# EAGLE design decoder (EAGLE 7.2.0)
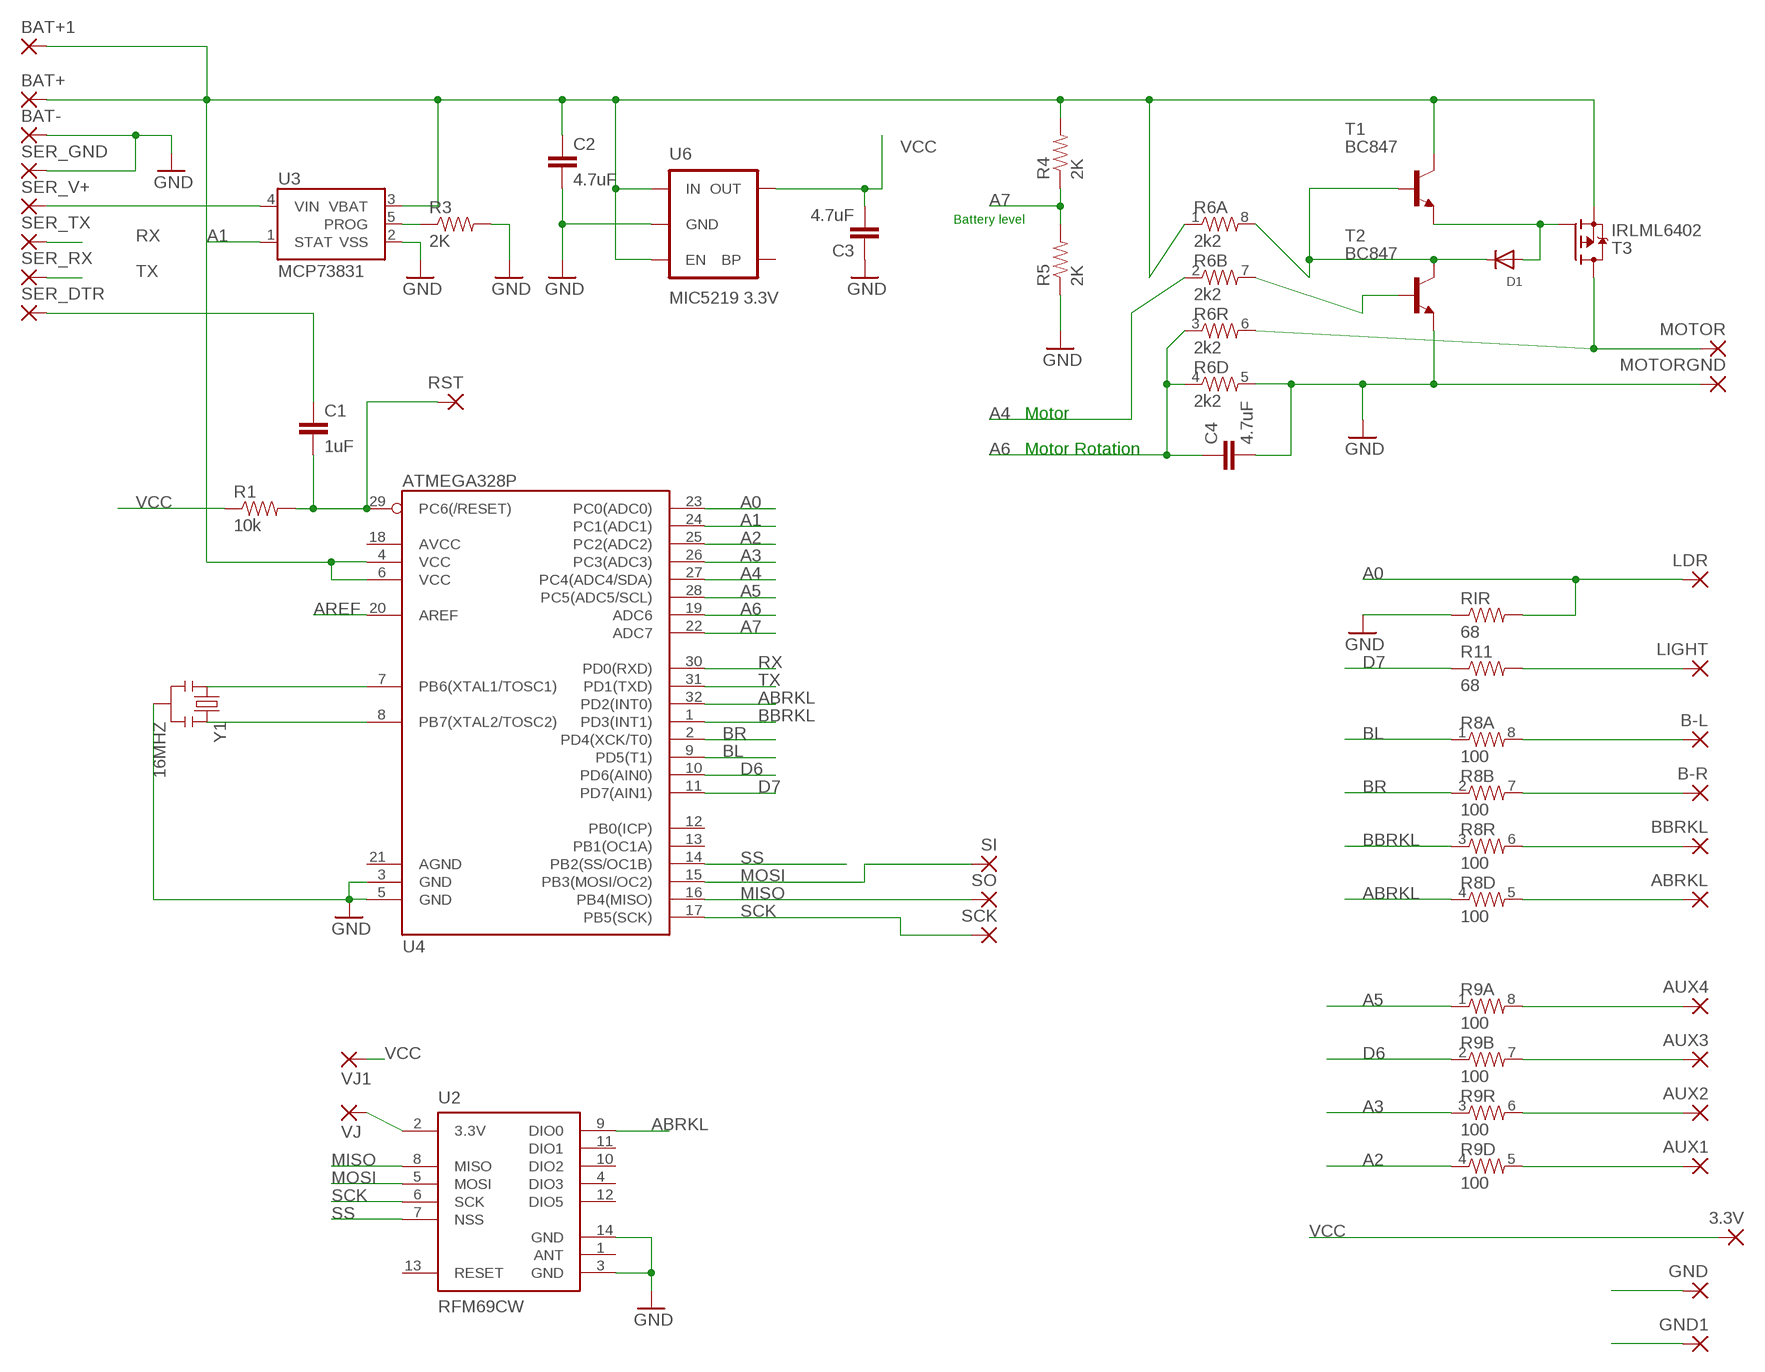
[diagram p0: schematic, sheet 1]

## Parts
3.3V  SMD2  [SMD1,27-2,54]
ABRKL  SMD2  [SMD1,27-2,54]
AUX1  SMD2  [SMD1,27-2,54]
AUX2  SMD2  [SMD1,27-2,54]
AUX3  SMD2  [SMD1,27-2,54]
AUX4  SMD2  [SMD1,27-2,54]
B-L  SMD2  [SMD1,27-2,54]
B-R  SMD2  [SMD1,27-2,54]
BAT+  SMD2  [SMD1,27-2,54]
BAT+1  SMD2  [SMD1,27-2,54]
BAT-  SMD2  [SMD1,27-2,54]
BBRKL  SMD2  [SMD1,27-2,54]
C1  1uF  CAP0805  [0805]
C2  4.7uF  CAP0805  [0805]
C3  4.7uF  CAP0805  [0805]
C4  4.7uF  CAP0805  [0805]
D1  DIODESOD-523  [SOD-523]
GND  SMD2  [SMD1,27-2,54]
GND1  SMD2  [SMD1,27-2,54]
LDR  SMD2  [SMD1,27-2,54]
LIGHT  SMD2  [SMD1,27-2,54]
MOTOR  SMD2  [SMD1,27-2,54]
MOTORGND  SMD2  [SMD1,27-2,54]
R1  10k  RESISTOR0603-RES  [0603-RES]
R3  2K  RESISTOR0603-RES  [0603-RES]
R4  2K  RESISTOR0603-RES  [0603-RES]
R5  2K  RESISTOR0603-RES  [0603-RES]
R6  2k2  RESISTOR-ARRAY0603-ARV  [0603-ARV]
R8  100  RESISTOR-ARRAY0603-ARV  [0603-ARV]
R9  100  RESISTOR-ARRAY0603-ARV  [0603-ARV]
R11  68  RESISTOR0603-RES  [0603-RES]
RIR  68  RESISTOR0603-RES  [0603-RES]
RST  SMD2  [SMD1,27-2,54]
SCK  SMD2  [SMD1,27-2,54]
SER_DTR  SMD2  [SMD1,27-2,54]
SER_GND  SMD2  [SMD1,27-2,54]
SER_RX  SMD2  [SMD1,27-2,54]
SER_TX  SMD2  [SMD1,27-2,54]
SER_V+  SMD2  [SMD1,27-2,54]
SI  SMD2  [SMD1,27-2,54]
SO  SMD2  [SMD1,27-2,54]
T1  BC847  [SOT23]
T2  BC847  [SOT23]
T3  IRLML6402  MOSFET-P-SOT23  [SOT23]
U2  RFM69CW  [RFM69CW-XXXS2]
U3  MCP73831  [SOT23-5]
U4  ATMEGA328P  ATMEGA328_SMT  [TQFP32-08]
U6  MIC5219 3.3V  V_REG_MIC52193.3V  [SOT23-5]
VJ  SMD2  [SMD1,27-2,54]
VJ1  SMD2  [SMD1,27-2,54]
Y1  16MHZ  RESONATOR16MHZ  [RESONATOR-SMD]

## Nets
A0: LDR.1(P) RIR.2 U4.23(PC0(ADC0))
A1: U3.1(STAT) U4.24(PC1(ADC1))
A2: R9.4 U4.25(PC2(ADC2))
A3: R9.3 U4.26(PC3(ADC3))
A4: R6.2 U4.27(PC4(ADC4/SDA))
A5: R9.1 U4.28(PC5(ADC5/SCL))
A6: C4.1 R6.3 R6.4 U4.19(ADC6)
A7: R4.1 R5.2 U4.22(ADC7)
ABRKL: R8.4 U2.9(DIO0) U4.32(PD2(INT0))
AREF: U4.20(AREF)
BAT+: BAT+1.1(P) BAT+.1(P) C2.1 R4.2 R6.1 T1.3(C) T3.2(S) U3.3(VBAT) U4.4(VCC) U4.6(VCC) U6.1(IN) U6.3(EN)
BBRKL: R8.3 U4.1(PD3(INT1))
BL: R8.1 U4.9(PD5(T1))
BR: R8.2 U4.2(PD4(XCK/T0))
D6: R9.2 U4.10(PD6(AIN0))
D7: R11.1 U4.11(PD7(AIN1))
GND: BAT-.1(P) C2.2 C3.1 C4.2 GND1.1(P) GND.1(P) MOTORGND.1(P) R3.2 R5.1 R6.5 RIR.1 SER_GND.1(P) T2.2(E) U2.3(GND) U2.14(GND) U3.2(VSS) U4.3(GND) U4.5(GND) U6.2(GND) Y1.2
M: AUX1.1(P) R9.5
MISO: SO.1(P) U2.8(MISO) U4.16(PB4(MISO))
MOSI: SI.1(P) U2.5(MOSI) U4.15(PB3(MOSI/OC2))
N$1: U2.2(3.3V) VJ.1(P)
N$2: U4.7(PB6(XTAL1/TOSC1)) Y1.1
N$3: C1.1 SER_DTR.1(P)
N$4: U4.8(PB7(XTAL2/TOSC2)) Y1.3
N$5: C1.2 R1.2 RST.1(P) U4.29(PC6(/RESET))
N$9: SER_V+.1(P) U3.4(VIN)
N$11: R3.1 U3.5(PROG)
N$12: LIGHT.1(P) R11.2
N$13: B-L.1(P) R8.8
N$14: D1.A T1.2(E) T3.1(G)
N$15: MOTOR.1(P) R6.6 T3.3(D)
N$16: B-R.1(P) R8.7
N$17: R6.7 T2.1(B)
N$18: BBRKL.1(P) R8.6
N$19: D1.K(C) R6.8 T1.1(B) T2.3(C)
N$20: ABRKL.1(P) R8.5
N$21: AUX4.1(P) R9.8
N$22: AUX3.1(P) R9.7
N$23: AUX2.1(P) R9.6
RX: SER_TX.1(P) U4.30(PD0(RXD))
SCK: SCK.1(P) U2.6(SCK) U4.17(PB5(SCK))
SS: U2.7(NSS) U4.14(PB2(SS/OC1B))
TX: SER_RX.1(P) U4.31(PD1(TXD))
VCC: 3.3V.1(P) C3.2 R1.1 U6.5(OUT) VJ1.1(P)
Unconnected: U2.1(ANT) U2.4(DIO3) U2.10(DIO2) U2.11(DIO1) U2.12(DIO5) U2.13(RESET) U4.12(PB0(ICP)) U4.13(PB1(OC1A)) U4.18(AVCC) U4.21(AGND) U6.4(BP)

## Notes on the sheet
- Battery level
- Motor
- Motor Rotation

## Library data of the parts
3.3V ABRKL AUX1-AUX4 B-L B-R BAT+ BAT+1 BAT- BBRKL GND GND1 LDR LIGHT MOTOR MOTORGND RST SCK SER_DTR SER_GND SER_RX SER_TX SER_V+ SI SO VJ VJ1 = wirepad:SMD2: SMD PAD
C1-C4 = SparkFun-Capacitors:CAP: Capacitor Standard 0603 ceramic capacitor, and 0.1" leaded capacitor.
D1 = adafruit:DIODE: Diode SMADIODE - SMA Surface Mount Package 20V 1A Schottky Diode Digikey: 641-1014-6-ND DO-1N4148 - Through Hole Small Current Diode SOD-123 20V 1 A (.5mV Vf) Schottky Diode - Digikey: MBRX120TPMSCT-ND SOD-323 10V 570mA (.38mV Vf, 3ns) Schottky Diode - Digikey: ZLLS410CT-ND SOD-523 30V 30mA Schottky Diode (RB751S-40TE61) - Digikey: RB751S-40TE61CT-ND SOT23-R/W - SOT23 Package (R = Solder Paste/Reflow Ovens, W = Hand-Soldering) BAT54Film 40V 300mA - Digikey: 497-7162-1-ND
R1 R3-R5 R11 RIR = SparkFun-Resistors:RESISTOR: Resistor Basic schematic elements and footprints for 0603, 1206, and PTH resistors.
R6 R8 R9 = SparkFun-Resistors:RESISTOR-ARRAY: Array Chip Resistor Source: RS Component / Phycomp
T1 T2 = transistor:BC847: NPN TRANSISTOR
T3 = we-transistor:MOSFET-P: P-Channel MOSFET (e.g. IRLML6402)
U2 = SparkFun-RF:RFM69
U3 = SparkFun-PowerIC:MCP73831: Miniature single cell, fully integrated Li-Ion, Li-polymer charge management controller http://ww1.microchip.com/downloads/en/DeviceDoc/21984a.pdf IC-09995; PROD_ID: IC-09995
U4 = SparkFun-DigitalIC:ATMEGA328_SMT: 32-Pin Atmega328 part Commonly used on Arduino compatible boards Available in QFP and QFN packages TQFP is IC-09069 QFN is non-stock; PROD_ID: IC-09069
U6 = SparkFun-PowerIC:V_REG_MIC5219: V_REG MIC5219 Standard 3.3V and 5V 500mA LDO voltage regulator in SOT-23 layout. Micrel part MIC5219. BP (by-pass) pin is used to lower output noise with 470pF cap, may be left open.; PROD_ID: VREG-09872
Y1 = SparkFun-FreqCtrl:RESONATOR: Resonator Small SMD resonator. Used, eg, on the Arduino Pro/ Pro Mini boards. 8MHz- XTAL-08895 16MHz- XTAL-08900; PROD_ID: XTAL-08900

## Board
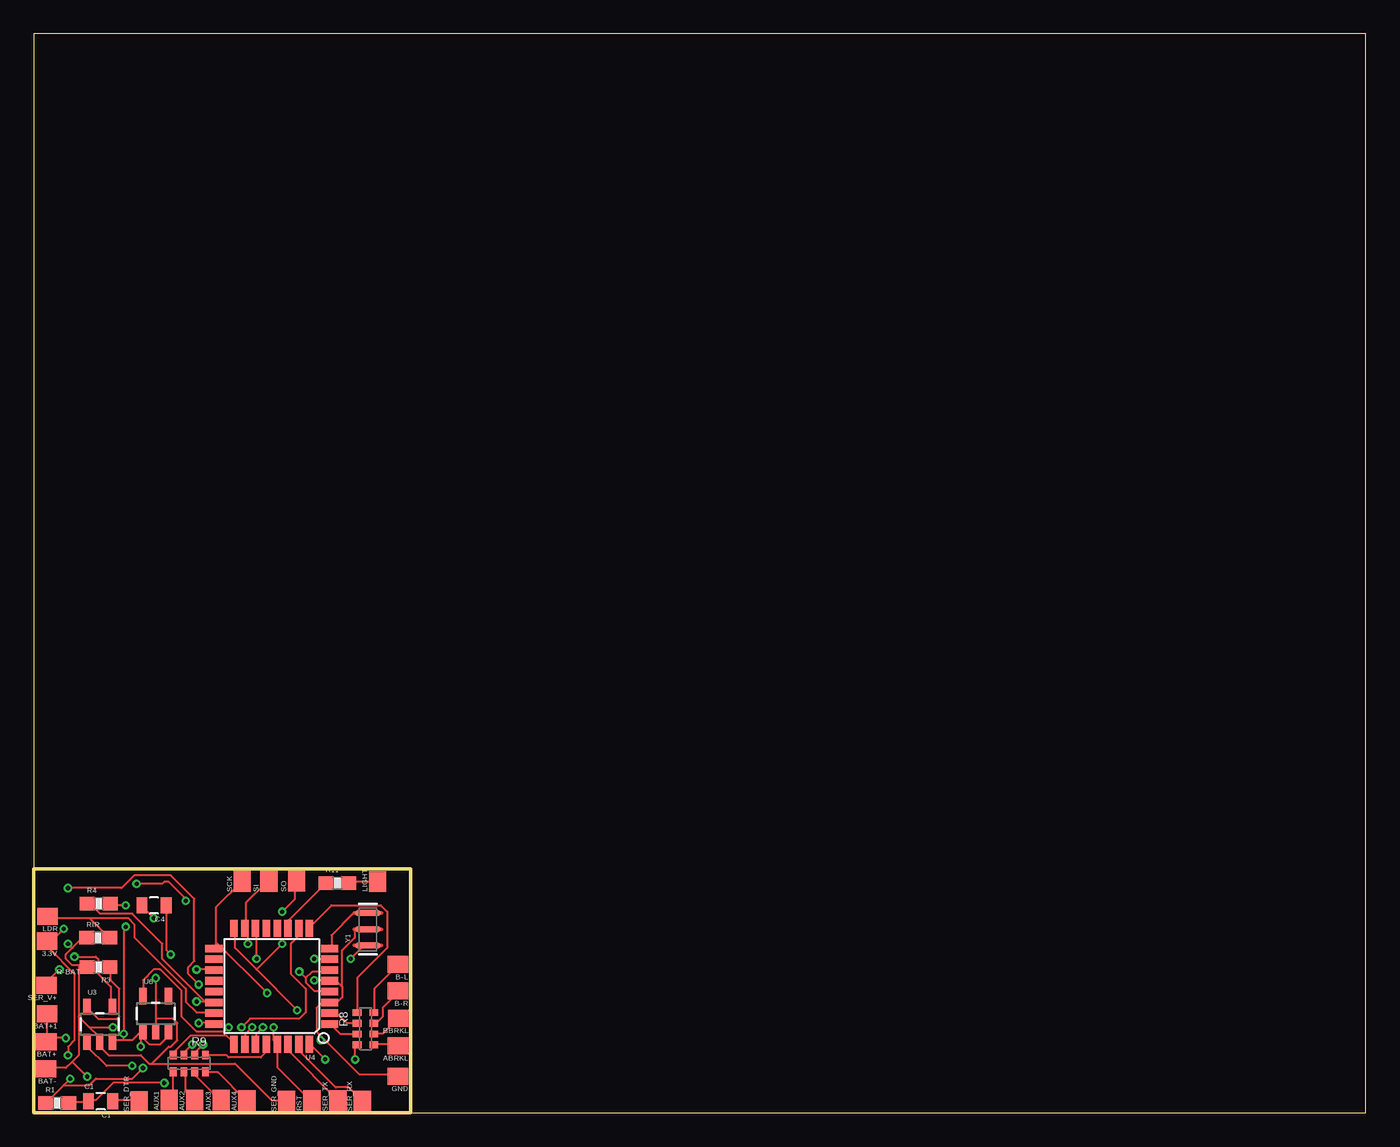
[diagram p1: board, top side]
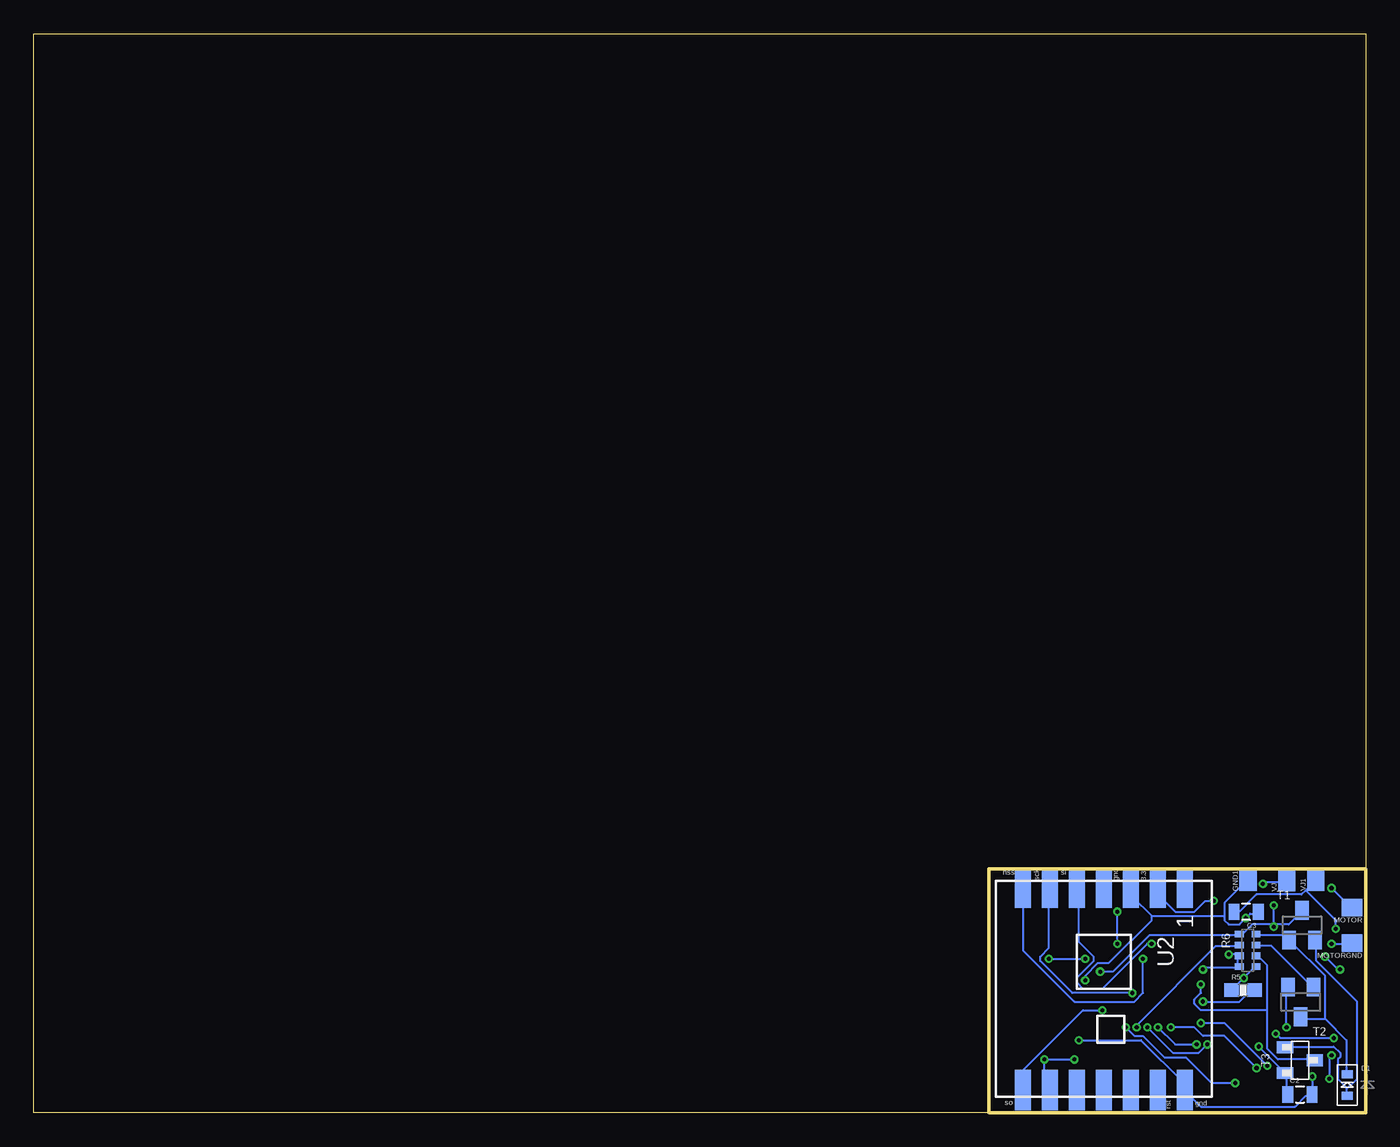
[diagram p2: board, bottom side, seen from below]

Size 98.73 x 80 mm. Coordinates in mm from the lower left corner, seen from the top.
Outline: 27.95,0 98.73,0 98.73,80 0,80 0,18.09
Outline: 0,18.09 27.95,18.09 27.95,0
Outline: 27.95,0 0,0 0,18.09
Copper layers (1*16): Top 0.035mm / dielectric 1.5mm / Bottom 0.035mm
Design rules "Elecrow_2-layer_eagle_rule": minimum track width 6mil, minimum drill 12mil, track to track 6mil, track to pad 6mil, pad to pad 6mil, via to via 6mil, smd to smd 0mil, copper to edge 10mil, drill to drill 10mil, minimum pad ring 10mil, minimum via ring 6mil, stop-mask expansion 2mil, vias tented up to drill 100mil, thermal gap 10mil

### Footprints (pad centres in the part's own frame; a part is rotated, then mirrored left to right if it is on the bottom)
SMD1,27-2,54 = smd 1.27 x 1.524: 1 0,0
0805 = smd 0.8 x 1.2: 1 -0.9,0; 2 0.9,0
SOD-523 = smd 0.8 x 0.6: A 0,-0.8; K 0,0.8
0603-RES = smd 1.1 x 1: 1 -0.85,0; 2 0.85,0
0603-ARV = smd 0.5 x 0.65: 1 -1.2,-0.625; 2 -0.4,-0.625; 3 0.4,-0.625; 4 1.2,-0.625; 5 1.2,0.625; 6 0.4,0.625; 7 -0.4,0.625; 8 -1.2,0.625
SOT23 = smd 1 x 1.4: 1 -0.95,-1.1; 2 0.95,-1.1; 3 0,1.1
SOT23' = smd 1.3 x 0.9: 1 -1.1,0.95; 2 -1.1,-0.95; 3 1.1,0
RFM69CW-XXXS2 = smd 3 x 1.2: 1 -7.5,6; 2 -7.5,4; 3 -7.5,2; 4 -7.5,0; 5 -7.5,-2; 6 -7.5,-4; 7 -7.5,-6; 8 7.5,-6; 9 7.5,-4; 10 7.5,-2; 11 7.5,0; 12 7.5,2; 13 7.5,4; 14 7.5,6
SOT23-5 = smd 0.55 x 1.2: 1 -0.95,-1.3; 2 0,-1.3; 3 0.95,-1.3; 4 0.95,1.3; 5 -0.95,1.3
TQFP32-08 = smd 1.27 x 0.559: 1 -4.293,2.8; 2 -4.293,2; 3 -4.293,1.2; 4 -4.293,0.4; 5 -4.293,-0.4; 6 -4.293,-1.2; 7 -4.293,-2; 8 -4.293,-2.8; 17 4.293,-2.8; 18 4.293,-2; 19 4.293,-1.2; 20 4.293,-0.4; 21 4.293,0.4; 22 4.293,1.2; 23 4.293,2; 24 4.293,2.8 | smd 0.559 x 1.27: 9 -2.8,-4.293; 10 -2,-4.293; 11 -1.2,-4.293; 12 -0.4,-4.293; 13 0.4,-4.293; 14 1.2,-4.293; 15 2,-4.293; 16 2.8,-4.293; 25 2.8,4.293; 26 2,4.293; 27 1.2,4.293; 28 0.4,4.293; 29 -0.4,4.293; 30 -1.2,4.293; 31 -2,4.293; 32 -2.8,4.293
RESONATOR-SMD = smd 0.45 x 1.905: 1 -1.2,0; 2 0,0; 3 1.2,0

### Placement (x,y rotation side)
3.3V  0.98,12.74 90 top
ABRKL  27.01,4.98 90 top
AUX1  10.04,0.97 0 top
AUX2  11.93,0.95 0 top
AUX3  13.89,0.95 0 top
AUX4  15.8,0.93 0 top
B-L  26.99,11.01 90 top
B-R  26.99,9.04 90 top
BAT+  0.92,5.28 90 top
BAT+1  0.97,7.36 90 top
BAT-  0.91,3.28 90 top
BBRKL  27.02,7.02 90 top
C1  4.96,0.86 180 top
C2  4.88,1.37 0 bottom
C3  8.87,14.91 180 bottom
C4  8.91,15.38 180 top
D1  1.37,2.08 0 bottom
GND  26.98,2.72 90 top
GND1  8.72,17.21 0 bottom
LDR  1.02,14.58 90 top
LIGHT  25.49,17.15 0 top
MOTOR  1.02,15.23 90 bottom
MOTORGND  1.02,12.6 90 bottom
R1  1.75,0.74 0 top
R3  4.81,10.81 180 top
R4  4.81,15.52 0 top
R5  9.09,9.09 0 bottom
R6  8.75,12.05 270 bottom
R8  24.59,6.25 270 top
R9  11.53,3.67 180 top
R11  22.5,17.05 0 top
RIR  4.77,12.99 0 top
RST  20.62,0.92 0 top
SCK  15.46,17.17 0 top
SER_DTR  7.81,0.86 0 top
SER_GND  18.75,0.87 0 top
SER_RX  24.36,0.9 0 top
SER_TX  22.55,0.91 0 top
SER_V+  0.95,9.47 90 top
SI  17.43,17.17 0 top
SO  19.48,17.17 0 top
T1  4.72,13.92 0 bottom
T2  4.83,8.23 180 bottom
T3  IRLML6402  [SOT23']  4.88,3.91 0 bottom
U2  19.41,9.19 270 bottom
U3  4.89,6.57 0 top
U4  17.65,9.4 180 top
U6  9.04,7.37 0 top
VJ  5.84,17.18 0 bottom
VJ1  3.7,17.23 0 bottom
Y1  24.77,13.62 90 top

### Tracks (layer width: path | path; a pad name or v marks a point on that pad's centre or on a via)
A0
  Top 0.152: 4.13,14.45 5.56,13.02 RIR.2 | 4.13,14.45 1.11,14.45 LDR.1 | 4.13,14.45 6.99,14.45 7.46,13.97 7.46,13.02 11.27,9.21 11.27,8.26 12.07,7.46 13.34,7.46 U4.23
A1  (via drill 0.3)
  Top 0.152: v7.3,3.49 5.4,3.49 3.97,4.92 3.97,5.24 U3.1 | v12.22,6.67 13.34,6.67 U4.24
  Bottom 0.152: v7.3,3.49 10.48,6.67 v12.22,6.67
A2
  Top 0.152: R9.4 10.48,4.45 10.48,4.6 11.59,5.71 14.29,5.71 14.76,5.24 U4.25
A3  (via drill 0.3)
  Top 0.152: v11.75,5.08 11.27,4.6 11.27,4.45 R9.3 | v16.19,6.35 15.72,5.87 15.72,5.24 U4.26
  Bottom 0.152: v11.75,5.08 12.38,4.45 14.29,4.45 v16.19,6.35
A4  (via drill 0.3)
  Top 0.152: v16.99,6.35 16.51,5.87 16.51,5.24 U4.27
  Bottom 0.152: v16.99,6.35 16.99,6.51 11.11,12.38 9.53,12.38 R6.2
A5
  Top 0.152: R9.1 12.86,4.29 14.29,4.29 14.45,4.13 16.83,4.13 17.14,4.45 17.14,5.08 U4.28
A6  (via drill 0.3)
  Top 0.152: v12.07,10.64 13.34,10.64 U4.19 | v10.16,11.75 9.84,12.06 9.84,15.24 C4.1
  Bottom 0.152: v12.07,10.64 11.91,10.79 9.53,10.79 R6.4 9.53,10.95 9.53,11.59 R6.3 9.53,11.75 v10.16,11.75
A7  (via drill 0.3)
  Top 0.152: 12.7,8.26 13.34,8.26 U4.22 | 12.7,8.26 v12.07,8.26 | 12.7,8.26 9.53,11.43 9.53,12.54 7.3,14.76 4.92,14.76 4.29,15.4 3.97,15.4 R4.1
  Bottom 0.152: v12.07,8.26 9.37,8.26 8.57,9.05 8.26,9.05 R5.2
ABRKL  (via drill 0.3)
  Top 0.152: v23.81,3.97 23.81,4.92 R8.4 | v21.59,3.97 20.48,5.08 U4.32
  Bottom 0.152: U2.9 23.5,1.75 23.81,2.06 v23.81,3.97 v21.59,3.97
BAT+  (via drill 0.3)
  Top 0.152: 0.95,5.56 0.95,7.3 BAT+1.1 | 0.95,5.56 0.95,5.4 BAT+.1 0.95,5.56 | 6.67,5.4 7.3,5.4 7.78,5.87 | 6.67,5.4 5.87,5.4 U3.3 | 7.78,5.87 7.94,6.03 U6.1 7.94,5.71 | 7.78,5.87 7.94,5.71 | 7.94,5.71 8.57,5.08 9.37,5.08 9.84,5.56 9.84,6.03 U6.3 | 7.94,5.71 v7.94,4.92 | v2.38,5.56 0.95,5.56 | 6.67,5.4 v6.67,5.87 6.67,13.65 v6.83,13.81 | 20.16,10 20.16,9.68 20.8,9.05 21.91,9.05 U4.4 | 20.16,10 20.64,10.48 21.91,10.48 U4.6 | v6.83,15.4 5.71,15.4 R4.2 | v19.68,10.48 20.16,10
  Bottom 0.152: C2.1 5.87,1.43 5.87,2.86 T3.2 6.03,3.02 v7.94,4.92 | v2.38,5.56 6.35,5.56 v6.67,5.87 | 6.83,13.97 5.71,13.97 4.76,14.92 T1.3 | 6.83,13.97 8.41,13.97 9.05,13.34 9.37,13.34 R6.1 9.53,13.18 16.03,13.18 18.73,10.48 v19.68,10.48 | 6.83,13.97 v6.83,15.4 | 6.83,13.97 v6.83,13.81
BBRKL
  Top 0.152: R8.3 23.81,5.87 22.7,5.87 22.07,6.51 U4.1
BL
  Top 0.152: R8.1 23.97,7.46 23.97,10 26.19,12.22 26.19,14.92 25.72,15.4 22.07,15.4 20.48,13.81 U4.9
BR
  Top 0.152: R8.2 23.81,6.67 23.18,6.67 22.54,7.3 22.07,7.3 U4.2
D6  (via drill 0.3)
  Top 0.152: v12.54,5.08 12.07,4.6 12.07,4.45 R9.2 | v15.4,6.35 16.03,6.99 19.68,6.99 20.16,7.46 20.16,9.21 19.05,10.32 19.05,12.54 19.53,13.02 19.53,13.65 U4.10
  Bottom 0.152: v12.54,5.08 14.13,5.08 v15.4,6.35
D7
  Top 0.152: R11.1 21.59,16.99 18.89,14.29 18.89,13.81 U4.11
GND  (via drill 0.3)
  Top 0.152: v9.05,10 9.05,6.99 | 9.05,6.99 9.05,6.19 U6.2 | 2.86,12.22 2.38,11.75 2.38,11.43 2.86,10.95 3.33,10.95 | 2.86,12.22 3.49,12.86 3.81,12.86 RIR.1 | 3.33,10.95 3.81,10.95 R3.2 | 3.33,7.14 4.13,6.35 | 4.13,6.35 4.76,5.71 4.76,5.4 U3.2 4.92,5.24 4.92,4.92 5.56,4.29 7.94,4.29 8.57,3.65 8.73,3.65 | 3.33,10.95 3.33,7.14 | 4.13,6.35 v5.87,6.35 | 8.73,3.65 14.92,3.65 17.62,0.95 18.73,0.95 SER_GND.1 | 2.86,3.81 3.33,4.29 3.33,7.14 | 2.86,3.81 2.38,3.33 0.95,3.33 BAT-.1 | 2.86,12.22 v2.54,12.54 | 9.05,6.99 10.32,6.99 10.64,6.67 10.64,5.4 10.16,4.92 10,4.92 8.73,3.65 | 2.86,3.81 v3.97,2.7 | v8.89,14.45 8.1,15.24 C4.2 | 22.86,9.37 22.86,8.57 22.54,8.26 22.07,8.26 U4.3 21.91,8.1 21.27,8.1 20.96,7.78 20.96,6.03 21.43,5.56 | 22.86,9.37 22.54,9.68 22.07,9.68 U4.5 21.91,9.84 v20.8,9.84 | 21.43,5.56 24.13,2.86 26.83,2.86 GND.1 | 22.86,9.37 22.86,12.06 23.81,13.02 23.81,13.49 23.75,13.62 | 21.43,5.56 v21.27,5.4
  Bottom 0.152: R6.5 8.26,10.79 v9.05,10 9.84,9.21 R5.1 | v5.87,6.35 5.87,9.21 T2.2 | v2.54,12.54 1.11,12.54 MOTORGND.1 | v3.97,2.7 3.97,1.43 C2.2 4.13,1.27 4.45,1.27 5.24,0.48 12.22,0.48 13.34,1.59 U2.14 13.49,1.75 13.49,2.22 16.67,5.4 v21.27,5.4 | 10.48,14.61 10.48,15.56 8.73,17.3 GND1.1 | 10.48,14.61 10.48,14.29 10.16,13.97 9.37,13.97 v8.89,14.45 8.57,14.76 8.1,14.76 C3.1 | 15.88,14.61 10.48,14.61 | 15.88,14.61 17.3,16.03 17.3,16.67 U2.3 | 15.88,14.61 15.88,14.29 19.05,11.11 19.84,11.11 20.8,10.16 v20.8,9.84
M
  Top 0.152: R9.5 10.32,3.02 10.32,1.27 10.16,1.11 AUX1.1
MISO  (via drill 0.3)
  Top 0.152: v19.53,7.62 16.51,10.64 | 16.51,10.64 14.92,12.22 14.92,13.65 U4.16 | v18.41,14.92 19.37,15.88 19.37,17.14 SO.1 | 16.51,10.64 v18.41,12.54
  Bottom 0.152: v19.53,7.62 20.96,7.62 25.4,3.17 25.4,1.75 U2.8 | v18.41,12.54 v18.41,14.92
MOSI  (via drill 0.3)
  Top 0.152: SI.1 17.3,17.14 15.72,15.56 15.72,13.81 U4.15 15.72,13.65 15.88,13.49 v15.88,12.54
  Bottom 0.152: v15.88,12.54 16.19,12.54 19.53,9.21 20.96,9.21 21.43,9.68 21.43,10 20.16,11.27 20.16,11.59 21.27,12.7 21.27,16.67 U2.5
N$1  (via drill 0.3)
  Top 0.152: v7.62,16.99 9.53,16.99 9.68,17.14 10,17.14 11.27,15.88 v11.27,15.72
  Bottom 0.152: v7.62,16.99 7.46,17.14 5.87,17.14 VJ.1 | v11.27,15.72 11.91,15.72 12.7,14.92 14.13,14.92 15.4,16.19 15.4,16.67 U2.2
N$2  (via drill 0.3)
  Top 0.152: v20.8,11.43 21.91,11.43 U4.7 | v23.5,11.43 24.45,12.38 Y1.1
  Bottom 0.152: v23.5,11.43 v20.8,11.43
N$3
  Top 0.152: C1.1 5.87,0.95 7.78,0.95 SER_DTR.1
N$4
  Top 0.152: U4.8 22.07,12.22 22.07,13.18 23.65,14.76 23.75,14.82
N$5  (via drill 0.3)
  Top 0.152: R1.2 2.7,0.79 3.97,0.79 C1.2 4.13,0.95 4.6,0.95 5.87,2.22 v9.68,2.22 | RST.1 20.48,0.95 18.1,3.33 18.1,5.08 U4.29 17.94,5.24 17.78,5.4 v17.78,6.35
  Bottom 0.152: v9.68,2.22 11.43,2.22 13.34,4.13 14.92,4.13 16.51,5.71 17.14,5.71 v17.78,6.35
N$9  (via drill 0.3)
  Top 0.152: v3.02,11.59 4.6,11.59 4.76,11.43 4.76,10.32 5.71,9.37 5.71,7.94 U3.4 | v1.9,10.64 0.79,9.53 SER_V+.1
  Bottom 0.152: v3.02,11.59 2.06,10.64 v1.9,10.64
N$11
  Top 0.152: R3.1 5.71,10.79 5.71,9.84 6.35,9.21 6.35,7.14 6.19,6.99 4.76,6.99 3.97,7.78 U3.5
N$12
  Top 0.152: R11.2 23.5,17.14 25.4,17.14 LIGHT.1
N$13
  Top 0.152: R8.8 25.24,7.46 25.24,9.21 26.99,10.95 B-L.1
N$14
  Bottom 0.152: 1.43,1.75 1.43,1.91 2.06,2.54 2.06,3.97 1.9,4.13 1.9,4.45 2.38,4.92 5.87,4.92 T3.1 | 1.43,1.75 1.43,1.43 D1.A | 1.43,1.75 0.64,2.54 0.64,8.26 3.65,11.27 3.65,12.7 T1.2
N$15  (via drill 0.3)
  Top 0.152: v2.54,16.67 6.51,16.67 7.46,17.62 10.16,17.62 11.91,15.88 11.91,11.27 11.43,10.79 11.43,10.32 v12.22,9.53
  Bottom 0.152: 7.3,7.62 7.3,4.76 6.51,3.97 3.81,3.97 T3.3 | 7.3,7.62 7.3,10.95 7.94,11.59 8.1,11.59 R6.6 | v2.54,16.67 1.11,15.24 MOTOR.1 | v12.22,9.53 12.22,8.89 12.7,8.41 12.7,8.1 12.22,7.62 7.3,7.62
N$16
  Top 0.152: R8.7 25.24,6.67 25.4,6.67 25.88,7.14 25.88,7.78 26.99,8.89 B-R.1
N$17
  Bottom 0.152: R6.7 8.1,12.38 6.99,12.38 3.97,9.37 T2.1
N$18
  Top 0.152: R8.6 25.24,5.87 25.88,5.87 26.99,6.99 BBRKL.1
N$19
  Bottom 0.152: R6.8 8.1,13.18 6.03,13.18 5.71,12.86 T1.1 5.56,12.7 3.02,10.16 3.02,6.99 | 3.02,6.99 1.43,5.4 1.43,3.02 D1.K | 3.02,6.99 4.76,6.99 T2.3
N$20
  Top 0.152: R8.5 25.24,5.08 26.99,5.08 ABRKL.1
N$21
  Top 0.152: R9.8 12.86,3.02 13.65,3.02 15.72,0.95 AUX4.1
N$22
  Top 0.152: R9.7 12.07,3.02 12.07,2.7 13.81,0.95 AUX3.1
N$23
  Top 0.152: R9.6 11.27,3.02 11.27,1.59 11.91,0.95 AUX2.1
RX
  Top 0.152: U4.30 18.89,5.08 18.89,4.6 22.54,0.95 SER_TX.1
SCK  (via drill 0.3)
  Top 0.152: 13.49,12.7 13.49,15.24 15.4,17.14 SCK.1 | 13.49,12.7 13.49,12.22 U4.17 | 13.49,12.7 v17.3,8.89
  Bottom 0.152: v17.3,8.89 21.75,8.89 24.13,11.27 24.13,11.59 23.5,12.22 23.5,16.67 U2.6
SS  (via drill 0.3)
  Top 0.152: v16.51,11.43 16.51,13.65 U4.14
  Bottom 0.152: v16.51,11.43 16.51,8.89 17.14,8.26 21.59,8.26 25.4,12.06 25.4,16.67 U2.7
TX
  Top 0.152: U4.31 19.68,5.08 19.68,4.6 22.38,1.91 23.34,1.91 24.29,0.95 SER_RX.1
VCC  (via drill 0.3)
  Top 0.152: v2.7,2.54 2.22,2.06 | 2.22,2.06 0.95,0.79 R1.1 | v2.54,4.29 2.54,4.92 3.02,5.4 3.02,10.32 1.11,12.22 1.11,12.54 | 1.11,12.54 1.11,12.7 3.3V.1 1.11,12.54 | v14.45,6.35 14.13,6.03 12.07,6.03 10.95,7.14 10.95,9.05 9.37,10.64 8.89,10.64 8.1,9.84 8.1,8.73 U6.5 | v8.1,3.33 7.3,2.54 4.6,2.54 4.13,2.06 2.22,2.06 | 1.11,12.54 v2.22,13.65
  Bottom 0.152: 4.45,16.51 3.81,17.14 VJ1.1 | 4.45,16.51 4.76,16.19 8.1,16.19 9.37,14.92 9.68,14.92 C3.2 | v2.7,2.54 2.7,4.13 v2.54,4.29 | v14.45,6.35 12.7,6.35 12.07,5.71 10.48,5.71 v8.1,3.33 | 4.45,16.51 2.22,14.29 v2.22,13.65

### Text on the board
_tsilk: R-BAT | C1
_bsilk: si | hss | 3.3 | gnd | sck | gnd | so | rst